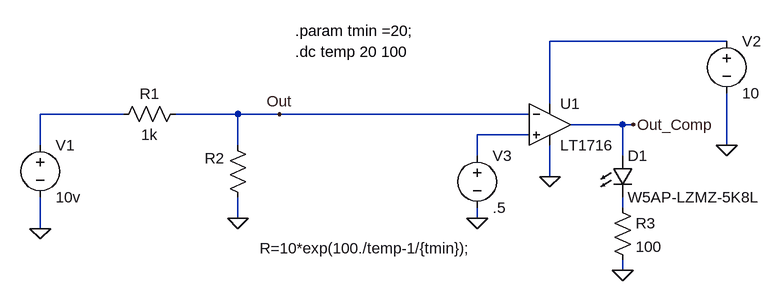
[diagram p0: schematic NTC.asc]
NTC.asc, the LTspice schematic file:
Version 4
SHEET 1 1148 680
WIRE 1072 -32 800 -32
WIRE 800 64 800 -32
WIRE 144 80 16 80
WIRE 320 80 224 80
WIRE 384 80 320 80
WIRE 768 80 384 80
WIRE 912 96 832 96
WIRE 928 96 912 96
WIRE 768 112 688 112
WIRE 16 128 16 80
WIRE 320 128 320 80
WIRE 1072 128 1072 48
WIRE 688 144 688 112
WIRE 912 144 912 96
WIRE 800 176 800 128
WIRE 912 224 912 208
WIRE 320 240 320 208
WIRE 688 240 688 224
WIRE 16 256 16 208
WIRE 912 320 912 304
FLAG 320 240 0
FLAG 16 256 0
FLAG 384 80 Out
FLAG 1072 128 0
FLAG 800 176 0
FLAG 688 240 0
FLAG 928 96 Out_Comp
FLAG 912 320 0
SYMBOL voltage 16 112 R0
SYMATTR InstName V1
SYMATTR Value 10v
SYMBOL res 240 64 R90
WINDOW 0 0 56 VBottom 2
WINDOW 3 32 56 VTop 2
SYMATTR InstName R1
SYMATTR Value 1k
SYMBOL res 336 224 R180
WINDOW 0 36 76 Left 2
WINDOW 3 -346 -62 Left 2
SYMATTR InstName R2
SYMATTR Value R=10*exp(100./temp-1/{tmin});
SYMBOL voltage 1072 -48 R0
SYMATTR InstName V2
SYMATTR Value 10
SYMBOL voltage 688 128 R0
WINDOW 123 0 0 Left 0
WINDOW 39 0 0 Left 0
SYMATTR InstName V3
SYMATTR Value .5
SYMBOL LED 896 144 R0
SYMATTR InstName D1
SYMATTR Value W5AP-LZMZ-5K8L
SYMATTR Description Diode
SYMATTR Type diode
SYMBOL res 896 208 R0
SYMATTR InstName R3
SYMATTR Value 100
SYMBOL Comparators\\LT1716 800 96 R0
SYMATTR InstName U1
TEXT 408 -48 Left 2 !.param tmin =20;
TEXT 408 -16 Left 2 !.dc temp 20 100

The netlist it stands for:
* NTC.asc
V1 N002 0 10v
R1 Out N002 1k
R2 0 Out R=10*exp(100./temp-1/{tmin});
V2 N001 0 10
V3 N003 0 .5
D1 Out_Comp N004 W5AP-LZMZ-5K8L
R3 N004 0 100
XU1 N003 Out N001 0 Out_Comp LT1716  ; pins In+ In- V+ V- OUT
.model D D
.lib standard.dio
.param tmin =20;
.dc temp 20 100
.lib LTC1.lib
.backanno
.end